# Altium schematic sheet Current-Sense-Sheet.SchDoc
size 420 x 297 mm; SheetNumber: 5; SheetTotal: 7
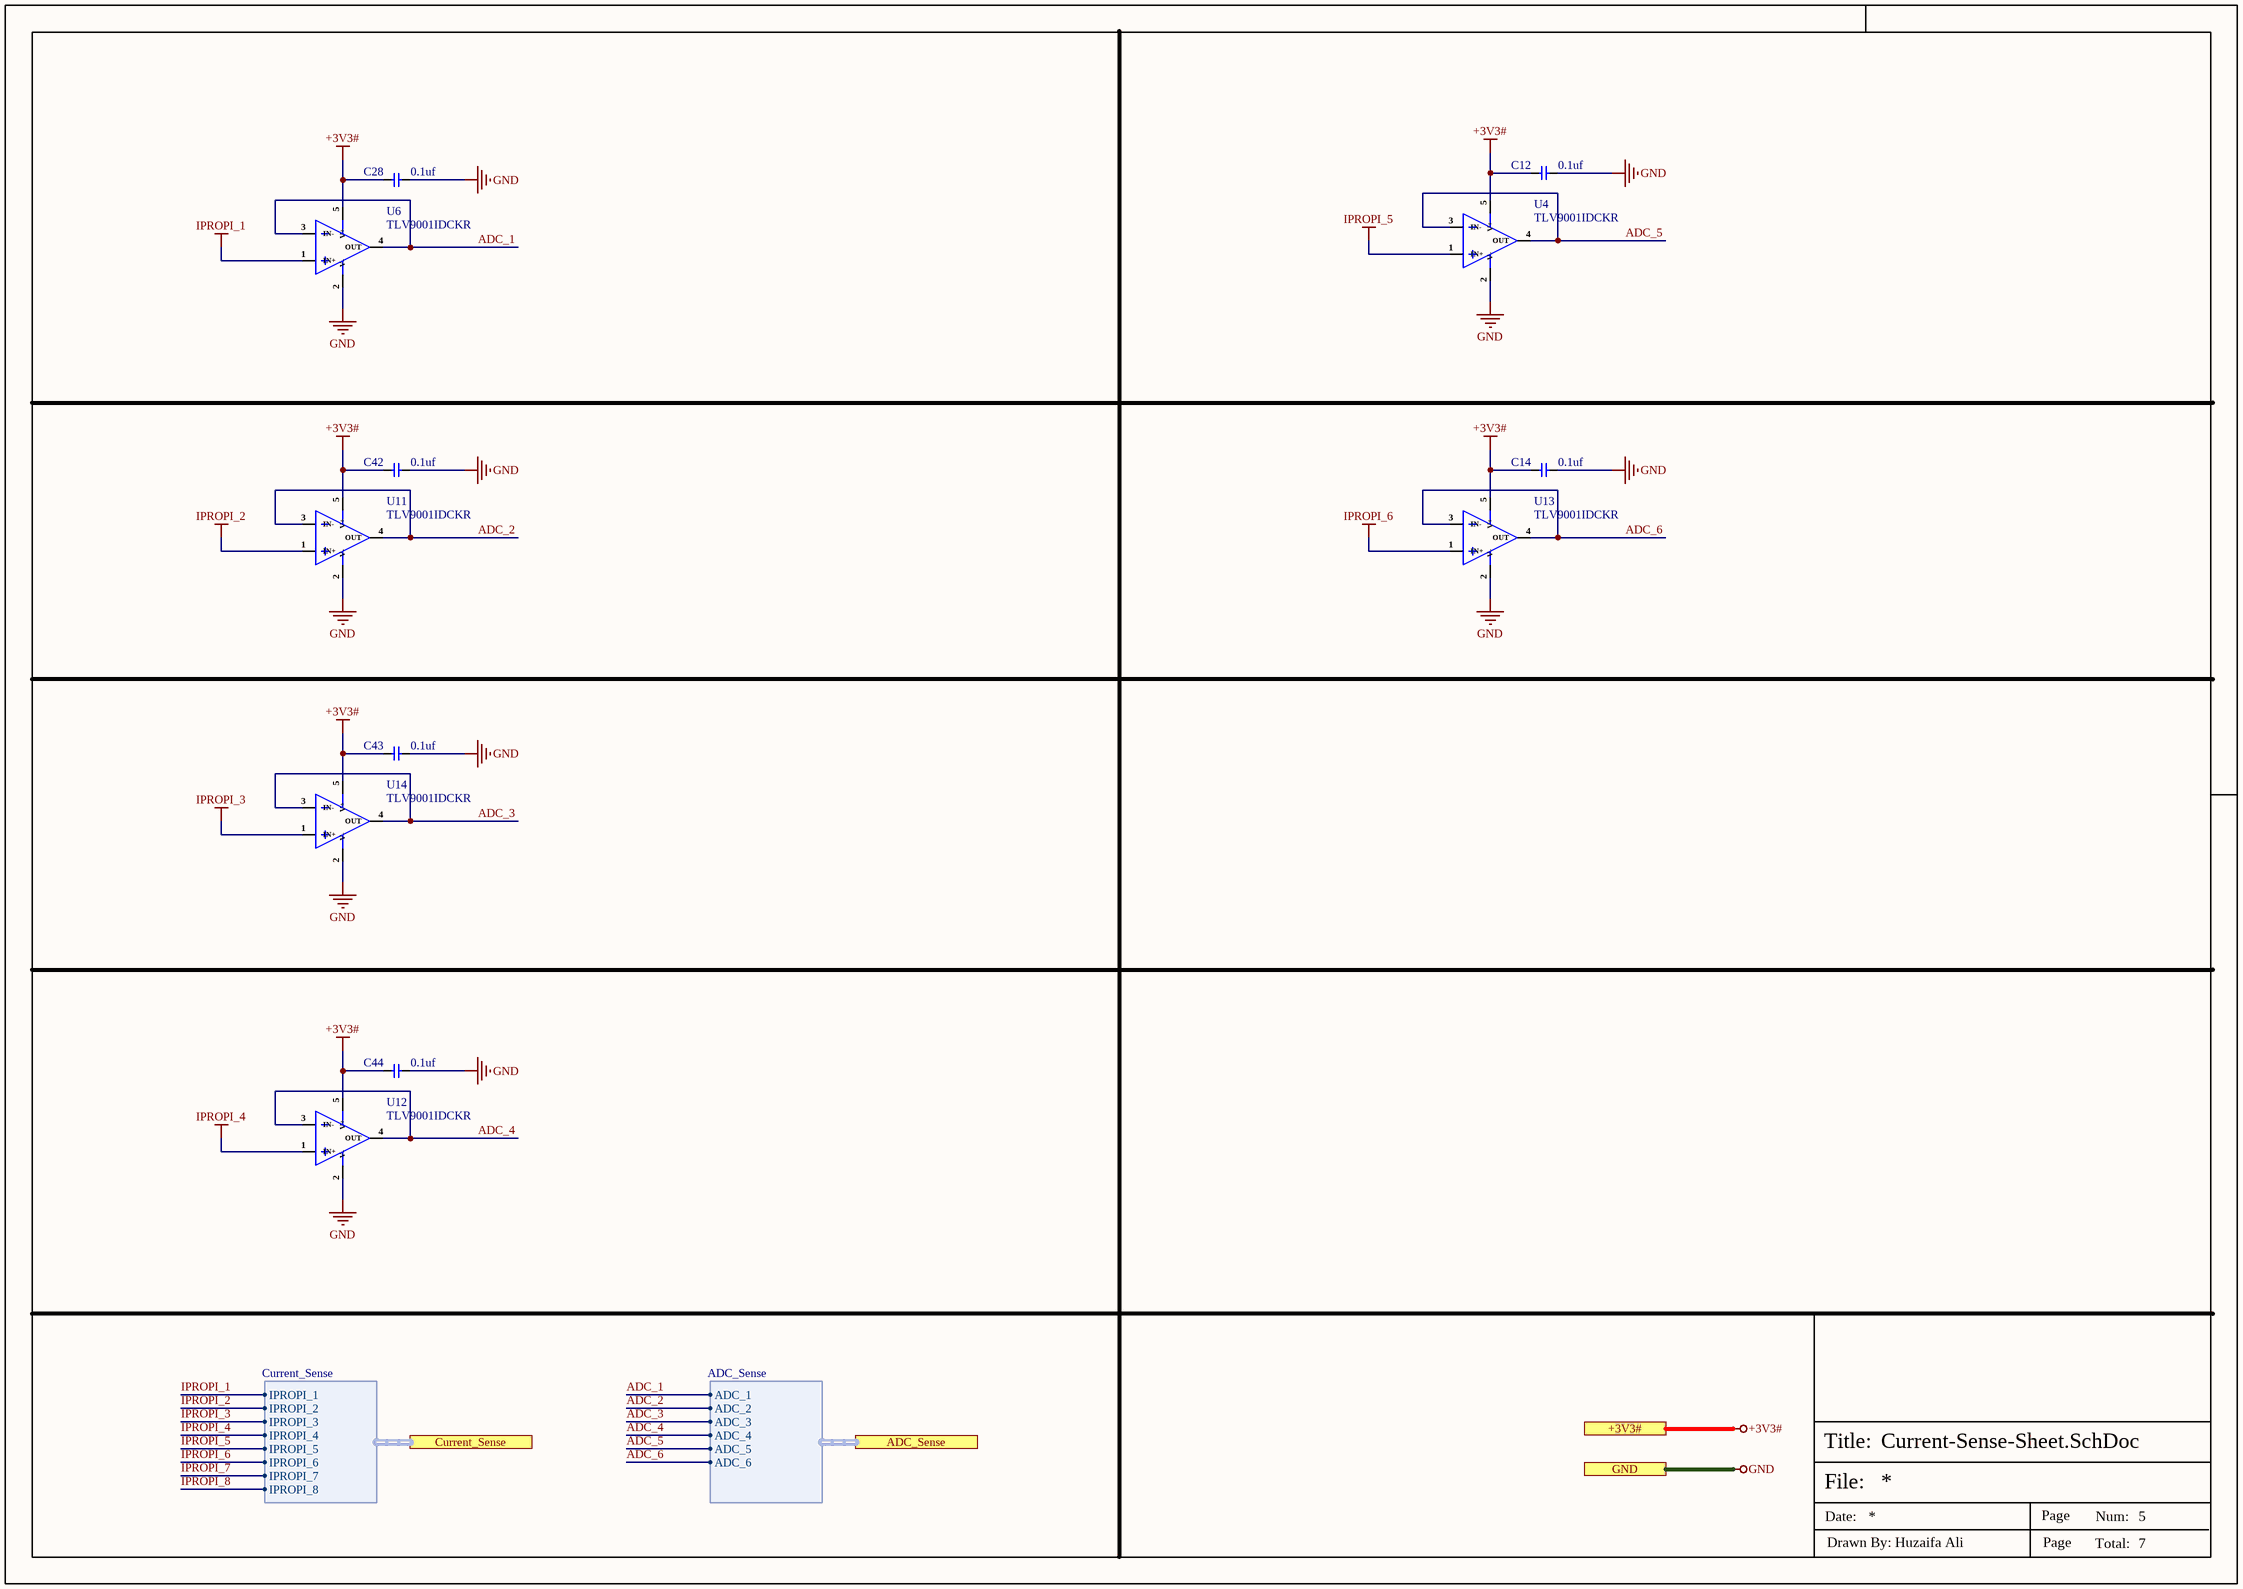
[diagram p0: Current-Sense-Sheet.SchDoc]

## Parts
C12  0.1uf  [Cap-0402]
C14  0.1uf  [Cap-0402]
C28  0.1uf  [Cap-0402]
C42  0.1uf  [Cap-0402]
C43  0.1uf  [Cap-0402]
C44  0.1uf  [Cap-0402]
U4  TLV9001IDCKR  [SC-70-5]
U6  TLV9001IDCKR  [SC-70-5]
U11  TLV9001IDCKR  [SC-70-5]
U12  TLV9001IDCKR  [SC-70-5]
U13  TLV9001IDCKR  [SC-70-5]
U14  TLV9001IDCKR  [SC-70-5]

## Ports
+3V3# (see Top-Sheet[4A], CAN-Sheet[5D], Controller-Sheet[5D]), ADC_Sense (harness ADC_Sense, see Top-Sheet[4B], Controller-Sheet[3D]), Current_Sense (harness Current_Sense, see Top-Sheet[5B], Motor-Driver-Sheet[2D]), GND (see Top-Sheet[4B], CAN-Sheet[5D], Connector-Sheet[5D], Controller-Sheet[5D], Motor-Connector[5D], Motor-Driver-Sheet[5D])

## Harnesses
Current_Sense: IPROPI_1, IPROPI_2, IPROPI_3, IPROPI_4, IPROPI_5, IPROPI_6, IPROPI_7, IPROPI_8
ADC_Sense: ADC_1, ADC_2, ADC_3, ADC_4, ADC_5, ADC_6

## Nets
+3V3#: C12.1 C14.1 C28.1 C42.1 C43.1 C44.1 U4.5(V+) U6.5(V+) U11.5(V+) U12.5(V+) U13.5(V+) U14.5(V+) ; port +3V3#
GND: C12.2 C14.2 C28.2 C42.2 C43.2 C44.2 U4.2(V-) U6.2(V-) U11.2(V-) U12.2(V-) U13.2(V-) U14.2(V-) ; port GND
IPROPI_1: U6.1(IN+) ; port Current_Sense.IPROPI_1
IPROPI_2: U11.1(IN+) ; port Current_Sense.IPROPI_2
IPROPI_3: U14.1(IN+) ; port Current_Sense.IPROPI_3
IPROPI_4: U12.1(IN+) ; port Current_Sense.IPROPI_4
IPROPI_5: U4.1(IN+) ; port Current_Sense.IPROPI_5
IPROPI_6: U13.1(IN+) ; port Current_Sense.IPROPI_6
ADC_1: U6.3(IN-) U6.4(OUT) ; port ADC_Sense.ADC_1
ADC_2: U11.3(IN-) U11.4(OUT) ; port ADC_Sense.ADC_2
ADC_3: U14.3(IN-) U14.4(OUT) ; port ADC_Sense.ADC_3
ADC_4: U12.3(IN-) U12.4(OUT) ; port ADC_Sense.ADC_4
ADC_5: U4.3(IN-) U4.4(OUT) ; port ADC_Sense.ADC_5
ADC_6: U13.3(IN-) U13.4(OUT) ; port ADC_Sense.ADC_6
IPROPI_7: port Current_Sense.IPROPI_7
IPROPI_8: port Current_Sense.IPROPI_8

## Notes on the sheet
- File:
- Title:
- Date:
- Page
- Num:
- Total:
- Drawn By: Huzaifa Ali

## Library data of the parts
C12 C14 C28 C42-C44 = GRM155R62A104KE14D: CAP CER 0.1UF 100V X5R 0402; Manufacturer: Murata; Capacitance: 100nF; Tolerance: 10%; Item Type: Capacitor; Supplier 1: Arrow Electronics; Manufacturer Part Number: GRM155R62A104KE14D; RoHS: Yes; Category: Ceramic Capacitors; Stock 1: 870000; Pricing 1: 10000=0.00500, 20000=0.00410, 30000=0.00390, 50000=0.00370, 100000=0.00300 (USD); Mount: Surface Mount; Case/Package: 0402; Case Code (Metric): 1005; Case Code (Imperial): 0402; Weight: 0.000212oz; Min Operating Temperature: -55°C; Max Operating Temperature: 85°C; Packaging: Tape and Reel; Voltage Rating: 100V; Dielectric: X5R; Termination: SMD/SMT; Voltage Rating (DC): 100V; Package Quantity: 10000; Series: GRM; Length: 0.039inch; Width: 0.02inch; Height: 0.5mm; Thickness: 0.022inch; Reach SVHC Compliant: Yes; Lead Free: Lead Free; RoHS Compliant: Yes; ComponentLink1URL: http://www.farnell.com/datasheets/2079151.pdf?src-supplier=Farnell; ComponentLink1Description: http://www.farnell.com/datasheets/2079151.pdf?src-supplier=Farnell; ComponentLink2URL: http://www.mouser.com/ds/2/281/c02e-2905.pdf?src-supplier=Mouser; ComponentLink2Description: http://www.mouser.com/ds/2/281/c02e-2905.pdf?src-supplier=Mouser; ComponentLink3URL: http://www.farnell.com/datasheets/2079151.pdf?src-supplier=Element14; ComponentLink3Description: http://www.farnell.com/datasheets/2079151.pdf?src-supplier=Element14; ComponentLink4URL: http://search.murata.co.jp/Ceramy/image/img/A01X/G101/ENG/GRM155R62A104KE14-01.pdf?src-supplier=Digi-Key; ComponentLink4Description: http://search.murata.co.jp/Ceramy/image/img/A01X/G101/ENG/GRM155R62A104KE14-01.pdf?src-supplier=Digi-Key; ComponentLink5URL: http://www.farnell.com/datasheets/2079151.pdf?src-supplier=Newark; ComponentLink5Description: http://www.farnell.com/datasheets/2079151.pdf?src-supplier=Newark; Supplier Part Number 1: GRM155R62A104KE14D; LCSC Part Number: C162178
U4 U6 U11-U14 = TLV9001IDCKR: IC CMOS 1 CIRCUIT SC70-5; Manufacturer: Texas Instruments; Number of Channels: 1; Slew Rate: 2V/µs; Gain Bandwidth Product: 1MHz; Input Bias Current: 5pA; Input Offset Voltage (Vos): 400uV; Operating Supply Current: 60uA; Output Current per Channel: 40mA; Supplier: Mouser; Supplier Part Number: 595-TLV9001IDCKR; Manufacturer Part Number: TLV9001IDCKR; RoHS: Yes; Item Type: IC; Stock: 13115; Pricing: 1=0.47, 10=0.348, 50=0.348, 100=0.194, 1000=0.146, 10000=0.117 (USD); Mounting Technology: Surface Mount; Min Operating Temperature: -40°C; Max Operating Temperature: 125°C; Packaging: Cut Tape; Number of Circuits: 1; Series: -; RoHS Compliant: Yes; ComponentLink1URL: http://www.ti.com/lit/ds/symlink/tlv9001.pdf?src-supplier=Digikey; ComponentLink1Description: http://www.ti.com/lit/ds/symlink/tlv9001.pdf?src-supplier=Digikey; LCSC Part Number: C398362